# EAGLE design Main_Board (EAGLE 9.4.2)
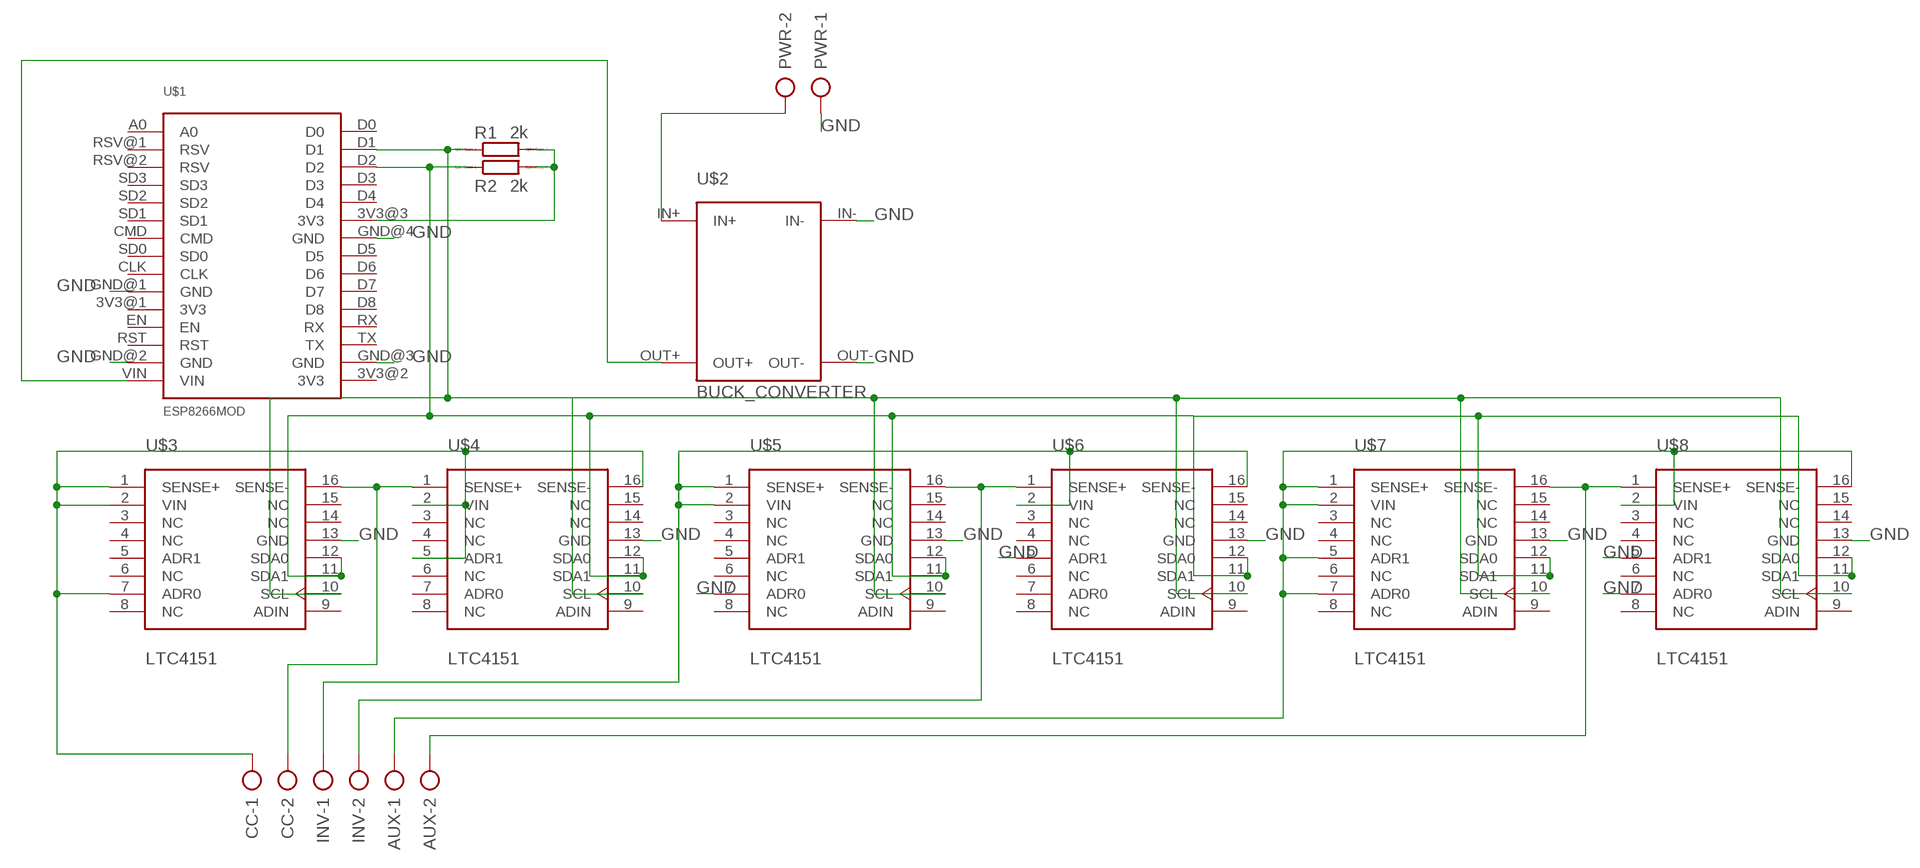
[diagram p0: schematic, sheet 1]

## Parts
AUX  AK500/2  [AK500/2]
CC  AK500/2  [AK500/2]
INV  AK500/2  [AK500/2]
PWR  AK500/2  [AK500/2]
R1  2k  R0207/10  [0207/10]
R2  2k  R0207/10  [0207/10]
U$1  ESP8266MOD  [ESP8266MOD]
U$2  BUCK_CONVERTER  [BUCK_CONVERTER]
U$3  LTC4151  [SO16]
U$4  LTC4151  [SO16]
U$5  LTC4151  [SO16]
U$6  LTC4151  [SO16]
U$7  LTC4151  [SO16]
U$8  LTC4151  [SO16]

## Nets
GND: PWR.1 U$1.GND@1(GND) U$1.GND@2(GND) U$1.GND@3(GND) U$1.GND@4(GND) U$2.IN- U$2.OUT- U$3.13(GND) U$4.13(GND) U$5.7(ADR0) U$5.13(GND) U$6.5(ADR1) U$6.13(GND) U$7.13(GND) U$8.5(ADR1) U$8.7(ADR0) U$8.13(GND)
N$1: PWR.2 U$2.IN+
N$3: U$1.VIN U$2.OUT+
N$4: CC.1 U$3.1(SENSE+) U$3.2(VIN) U$3.7(ADR0) U$4.2(VIN) U$4.5(ADR1) U$4.16(SENSE-)
N$5: CC.2 U$3.16(SENSE-) U$4.1(SENSE+)
N$7: INV.1 U$5.1(SENSE+) U$5.2(VIN) U$6.2(VIN) U$6.16(SENSE-)
N$8: INV.2 U$5.16(SENSE-) U$6.1(SENSE+)
N$10: AUX.1 U$7.1(SENSE+) U$7.2(VIN) U$7.5(ADR1) U$7.7(ADR0) U$8.2(VIN) U$8.16(SENSE-)
N$11: AUX.2 U$7.16(SENSE-) U$8.1(SENSE+)
N$13: R2.1 U$1.D2 U$3.11(SDA1) U$3.12(SDA0) U$4.11(SDA1) U$4.12(SDA0) U$5.11(SDA1) U$5.12(SDA0) U$6.11(SDA1) U$6.12(SDA0) U$7.11(SDA1) U$7.12(SDA0) U$8.11(SDA1) U$8.12(SDA0)
N$17: R1.2 R2.2 U$1.3V3@3(3V3)
N$21: R1.1 U$1.D1 U$3.10(SCL) U$4.10(SCL) U$5.10(SCL) U$6.10(SCL) U$7.10(SCL) U$8.10(SCL)
Unconnected: U$1.3V3@1(3V3) U$1.3V3@2(3V3) U$1.A0 U$1.CLK U$1.CMD U$1.D0 U$1.D3 U$1.D4 U$1.D5 U$1.D6 U$1.D7 U$1.D8 U$1.EN U$1.RST U$1.RSV@1(RSV) U$1.RSV@2(RSV) U$1.RX U$1.SD0 U$1.SD1 U$1.SD2 U$1.SD3 U$1.TX U$3.3(NC) U$3.4(NC) U$3.5(ADR1) U$3.6(NC) U$3.8(NC) U$3.9(ADIN) U$3.14(NC) U$3.15(NC) U$4.3(NC) U$4.4(NC) U$4.6(NC) U$4.7(ADR0) U$4.8(NC) U$4.9(ADIN) U$4.14(NC) U$4.15(NC) U$5.3(NC) U$5.4(NC) U$5.5(ADR1) U$5.6(NC) U$5.8(NC) U$5.9(ADIN) U$5.14(NC) U$5.15(NC) U$6.3(NC) U$6.4(NC) U$6.6(NC) U$6.7(ADR0) U$6.8(NC) U$6.9(ADIN) U$6.14(NC) U$6.15(NC) U$7.3(NC) U$7.4(NC) U$7.6(NC) U$7.8(NC) U$7.9(ADIN) U$7.14(NC) U$7.15(NC) U$8.3(NC) U$8.4(NC) U$8.6(NC) U$8.8(NC) U$8.9(ADIN) U$8.14(NC) U$8.15(NC)

## Library data of the parts
AUX CC INV PWR = con-ptr500:AK500/2: CONNECTOR; OC_FARNELL: unknown; OC_NEWARK: unknown
R1 R2 = eagle-ltspice:R: RESISTOR, European symbol; SPICEMODEL: NONE; SPICEPREFIX: R
U$1 = My_parts:ESP8266MOD
U$2 = My_parts:BUCK_CONVERTER
U$3-U$8 = My_parts:LTC4151

## Board
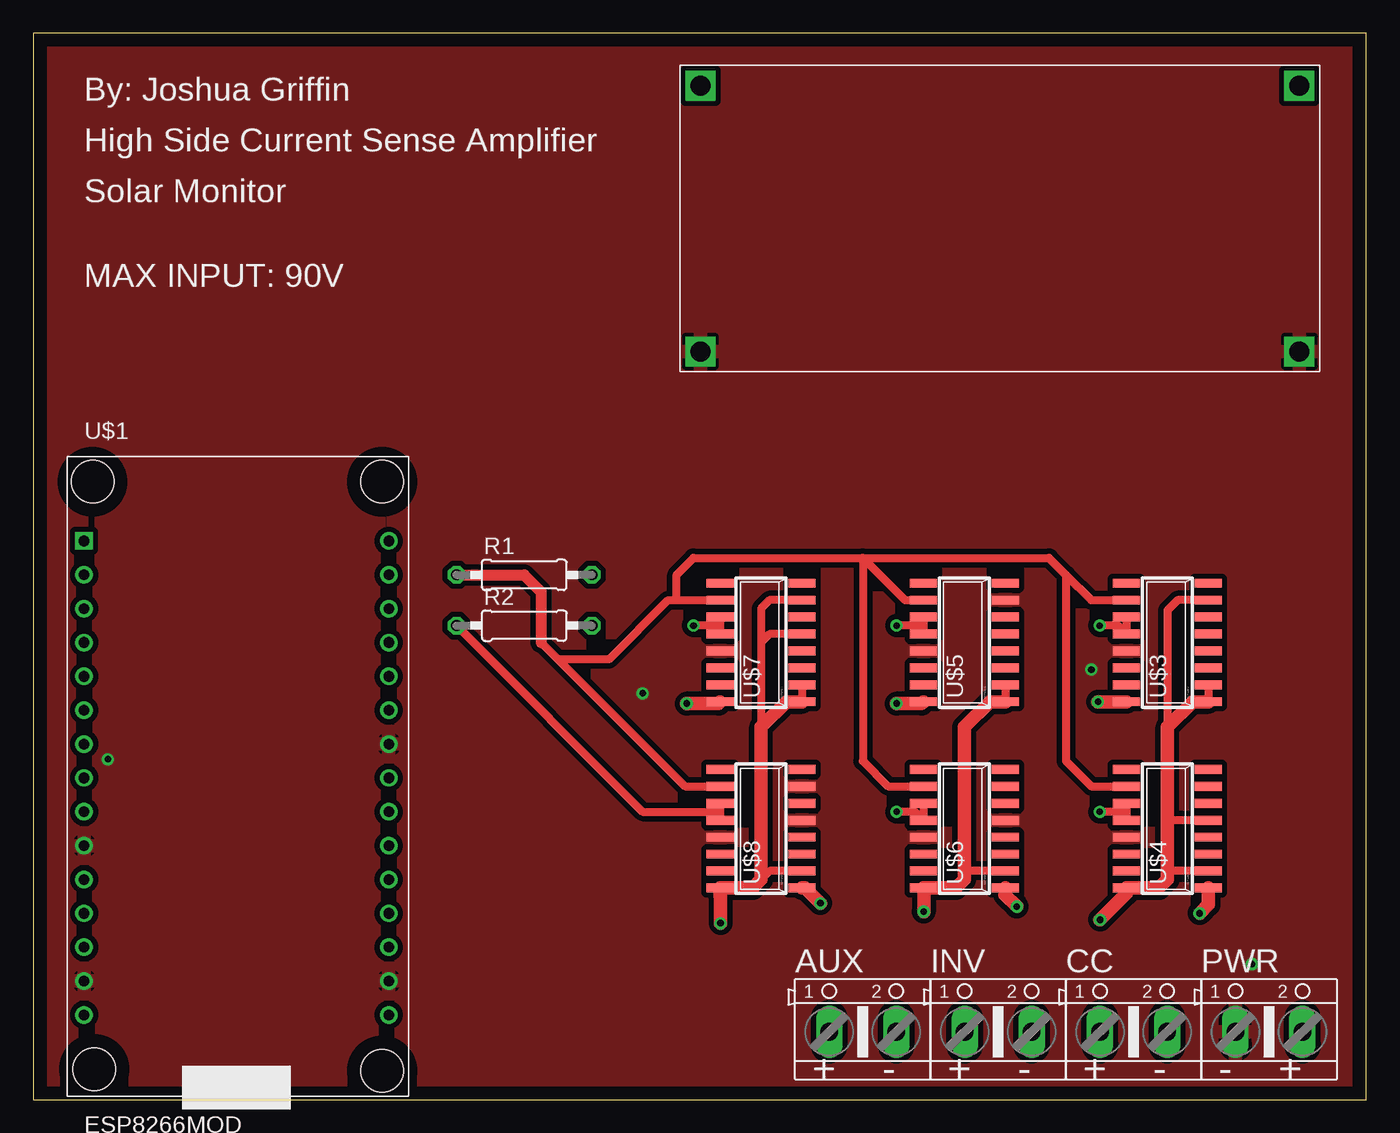
[diagram p1: board, top side]
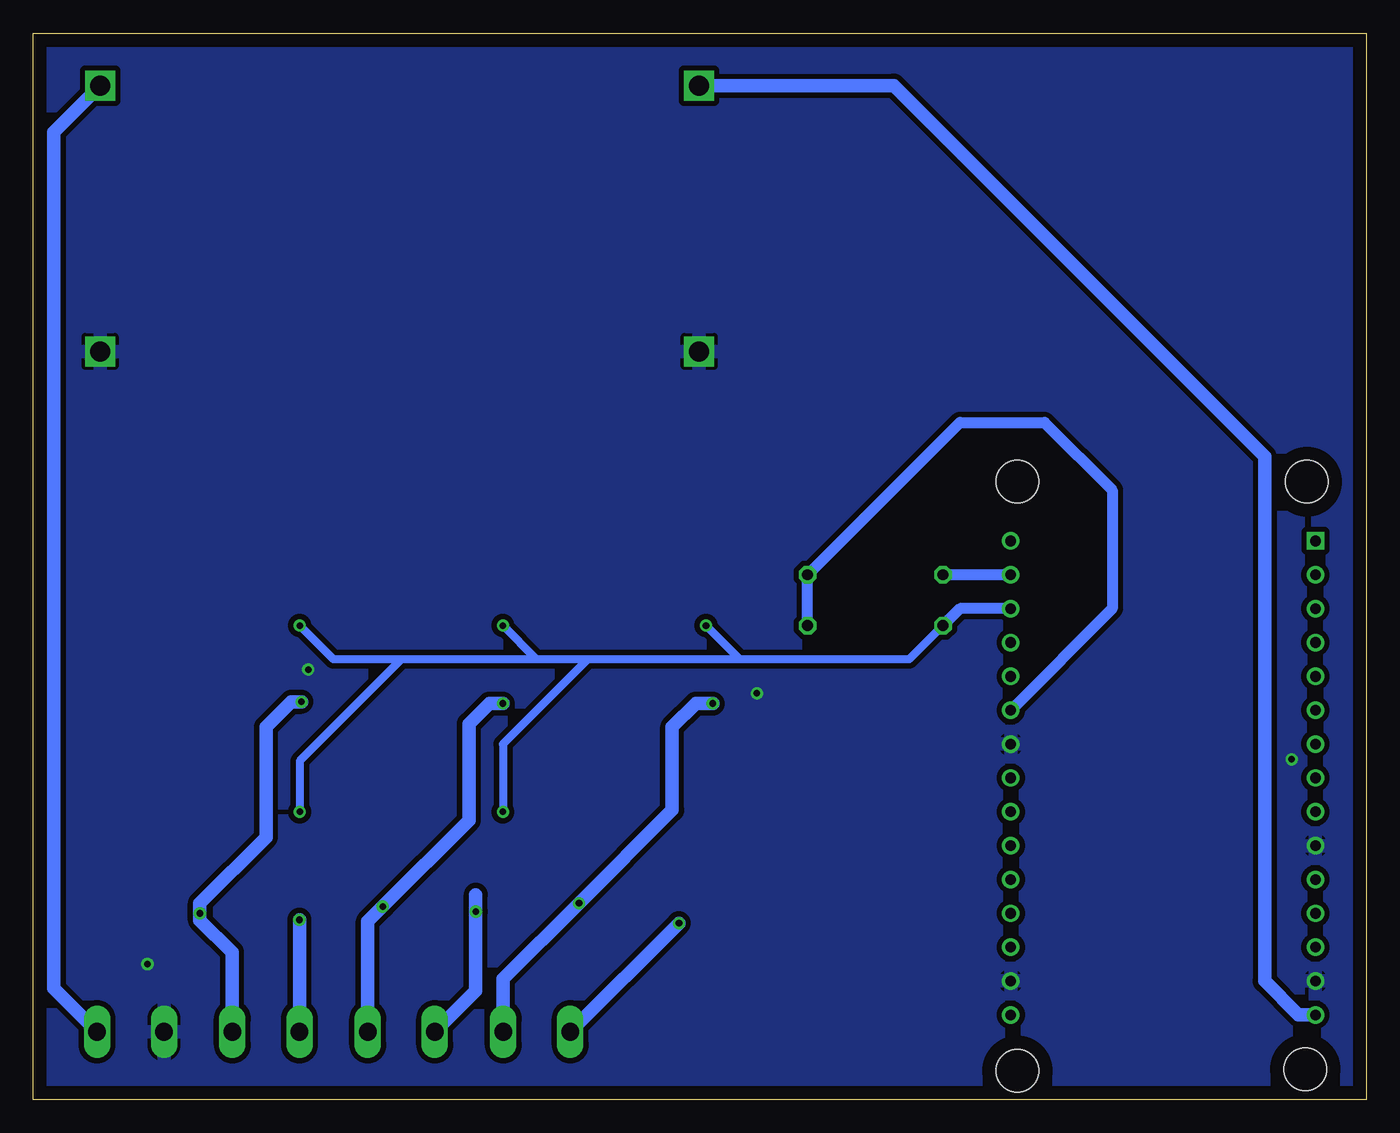
[diagram p2: board, bottom side, seen from below]

Size 100 x 80 mm. Coordinates in mm from the lower left corner, seen from the top.
Outline: 0,0 100,0 100,80 0,80 0,0
Copper layers (1*16): Top 0.035mm / dielectric 1.5mm / Bottom 0.035mm
Design rules "default *": minimum track width 0.4mm, minimum drill 0.5mm, track to track 0.4mm, track to pad 0.4mm, pad to pad 0.4mm, via to via 0.4mm, smd to smd 0.4mm, copper to edge 40mil, drill to drill 6mil, minimum pad ring 10mil, minimum via ring 8mil, stop-mask expansion 4mil, vias tented up to drill 0mil, thermal gap 10mil

### Footprints (pad centres in the part's own frame; a part is rotated, then mirrored left to right if it is on the bottom)
AK500/2 = drill 1.321 long: 1 -2.515,0; 2 2.515,0
0207/10 = drill 0.813 octagon: 1 -5.08,0; 2 5.08,0
ESP8266MOD = drill 0.8: 3V3@1 1.27,-31.75; 3V3@2 24.13,-41.91; 3V3@3 24.13,-19.05; CLK 1.27,-26.67; CMD 1.27,-21.59; D0 24.13,-6.35; D1 24.13,-8.89; D2 24.13,-11.43; D3 24.13,-13.97; D4 24.13,-16.51; D5 24.13,-24.13; D6 24.13,-26.67; D7 24.13,-29.21; D8 24.13,-31.75; EN 1.27,-34.29; GND@1 1.27,-29.21; GND@2 1.27,-39.37; GND@3 24.13,-39.37; GND@4 24.13,-21.59; RST 1.27,-36.83; RSV@1 1.27,-8.89; RSV@2 1.27,-11.43; RX 24.13,-34.29; SD0 1.27,-24.13; SD1 1.27,-19.05; SD2 1.27,-16.51; SD3 1.27,-13.97; TX 24.13,-36.83; VIN 1.27,-41.91 | drill 0.8 square: A0 1.27,-6.35 | hole 3.2: 2.032,-45.974; 23.622,-46.101; 23.622,-1.905; 1.905,-1.905
BUCK_CONVERTER = drill 1.5 square: IN+ 1.524,-21.463; IN- 1.524,-1.524; OUT+ 46.482,-21.463; OUT- 46.482,-1.524
SO16 = smd 0.66 x 2.032: 1 -4.445,-3.073; 2 -3.175,-3.073; 3 -1.905,-3.073; 4 -0.635,-3.073; 5 0.635,-3.073; 6 1.905,-3.073; 7 3.175,-3.073; 8 4.445,-3.073; 9 4.445,3.073; 10 3.175,3.073; 11 1.905,3.073; 12 0.635,3.073; 13 -0.635,3.073; 14 -1.905,3.073; 15 -3.175,3.073; 16 -4.445,3.073

### Placement (x,y rotation side)
AUX  62.23,5.08 0 top
CC  82.55,5.08 0 top
INV  72.39,5.08 0 top
PWR  92.71,5.08 0 top
R1  36.83,39.37 0 top
R2  36.83,35.56 0 top
U$1  2.54,48.26 0 top
U$2  96.52,54.61 180 top
U$3  85.09,34.29 90 top
U$4  85.09,20.32 90 top
U$5  69.85,34.29 90 top
U$6  69.85,20.32 90 top
U$7  54.61,34.29 90 top
U$8  54.61,20.32 90 top

### Tracks (layer width: path | path; a pad name or v marks a point on that pad's centre or on a via)
GND  (via drill 0.5)
  other vias: 79.38,32.26 45.72,30.48 91.44,10.16 5.59,25.53
  pour Bottom: -11.43,77.47 -1.27,87.63 1.27,87.63 100.33,87.63 109.22,78.74 109.22,5.08 99.06,-5.08 0,-5.08 -6.35,1.27 -11.43,6.35
  pour Top: -7.62,74.93 3.81,86.36 5.08,86.36 99.06,86.36 105.41,80.01 105.41,2.54 97.79,-5.08 -1.27,-5.08 -6.35,0 -7.62,1.27
N$1
  Bottom 1.016: U$2.IN+ 98.48,72.59 98.48,8.33 PWR.2
N$3
  Bottom 1.016: U$2.OUT+ 35.43,76.07 7.62,48.26 7.62,8.89 5.08,6.35 U$1.VIN
N$4  (via drill 0.5)
  Top 0.61: U$3.7 85.85,37.47 85.09,36.7 85.09,27.94 | U$3.2 U$3.1 | U$4.2 85.09,17.14 | U$4.5 85.09,20.95
  Top 1.016: U$3.1 87,29.84 85.09,27.94 85.09,20.95 85.09,17.14 85.09,16.51 84.45,15.88 U$4.16 82.02,15.47 v80.03,13.49
  Bottom 1.016: CC.1 v80.03,13.49
N$5  (via drill 0.5)
  Top 1.016: U$3.16 v79.88,29.84 | U$4.1 88.16,14.63 v87.5,13.97
  Bottom 1.016: v79.88,29.84 80.64,29.84 82.55,27.94 82.55,19.68 87.5,14.73 v87.5,13.97 87.5,13.46 85.09,11.05 85.09,5.11 CC.2
N$7  (via drill 0.5)
  Top 0.61: U$5.2 U$5.1 | U$6.2 69.98,17.14 69.85,17.02
  Top 0.813: U$6.16 66.8,15.85
  Top 1.016: U$6.16 69.22,15.88 69.85,16.51 69.85,17.02 69.85,27.94 71.75,29.84 U$5.1 | 66.8,15.85 v66.8,14.1
  Bottom 1.016: INV.1 66.8,8.15 v66.8,14.1 66.8,15.37
N$8  (via drill 0.5)
  Top 1.016: U$5.16 66.65,29.72 v64.77,29.72 | v73.79,14.48 72.9,15.37 72.92,15.39 U$6.1
  Bottom 1.016: INV.2 74.91,13.36 v73.79,14.48 67.31,20.95 67.31,28.19 65.79,29.72 v64.77,29.72
N$10  (via drill 0.5)
  Top 0.61: U$8.2 55.24,17.14 54.61,16.51 | U$7.2 U$7.1 | U$7.5 55.24,34.92 54.61,34.29 | 54.61,34.29 54.61,27.94 | U$7.7 55.24,37.47 54.61,36.83 54.61,34.29
  Top 1.016: U$7.1 56.52,29.84 54.61,27.94 54.61,16.51 53.98,15.88 U$8.16 51.54,15.27 51.56,15.24 v51.56,13.23
  Bottom 1.016: AUX.1 v51.56,13.23
N$11  (via drill 0.5)
  Top 1.016: U$7.16 51.41,29.72 v49.02,29.72 | U$8.1 57.91,15.88 v59.05,14.73
  Bottom 1.016: AUX.2 64.75,9.04 v59.05,14.73 52.07,21.72 52.07,27.94 50.29,29.72 v49.02,29.72
N$13  (via drill 0.5)
  Top 0.61: U$7.11 51.54,35.56 | 51.54,35.56 U$7.12 | U$8.11 51.54,21.59 | 51.54,21.59 U$8.12 | U$5.11 66.78,35.56 | 66.78,35.56 U$5.12 | U$6.11 U$6.12 66.14,21.59 v64.77,21.59 | U$4.11 82.02,21.59 | 82.02,21.59 U$4.12 | U$3.11 U$3.12 81.38,35.56 v80.01,35.56 | R2.1 45.72,21.59 51.54,21.59 | 51.54,35.56 v49.53,35.56 | 66.78,35.56 v64.77,35.56 | 82.02,21.59 v80.01,21.59
  Bottom 0.61: R2.1 34.29,33.02 46.99,33.02 | v49.53,35.56 46.99,33.02 | 46.99,33.02 58.42,33.02 | 58.42,33.02 62.23,33.02 | 62.23,33.02 v64.77,35.56 | 62.23,33.02 72.39,33.02 | 72.39,33.02 77.47,33.02 v80.01,35.56 | 58.42,33.02 64.77,26.67 v64.77,21.59 | 72.39,33.02 80.01,25.4 v80.01,21.59
  Bottom 0.813: U$1.D2 30.48,36.83 R2.1
N$17
  Bottom 0.813: R2.2 R1.2 30.48,50.8 24.13,50.8 19.05,45.72 19.05,36.83 U$1.3V3@3
N$21
  Top 0.61: 38.1,34.29 39.37,33.02 | 48.26,37.47 47.62,37.47 43.18,33.02 39.37,33.02 | 48.26,37.47 U$7.10 | 48.26,37.47 48.26,39.37 49.53,40.64 62.23,40.64 | U$5.10 65.41,37.47 62.23,40.64 | 62.23,40.64 76.2,40.64 77.47,39.37 | U$3.10 79.38,37.47 77.47,39.37 | 39.37,33.02 48.9,23.5 U$8.10 | 62.23,40.64 62.23,25.4 64.14,23.5 U$6.10 | 77.47,39.37 77.47,25.4 79.38,23.5 U$4.10
  Top 0.813: R1.1 36.83,39.37 38.1,38.1 38.1,34.29
  Bottom 0.813: U$1.D1 R1.1

### Text on the board
tNames: By: Joshua Griffin | High Side Current Sense Amplifier | Solar Monitor | MAX INPUT: 90V | + - | + - | + - | - +